# EAGLE design 3PDT Board wLED (EAGLE 9.5.2)
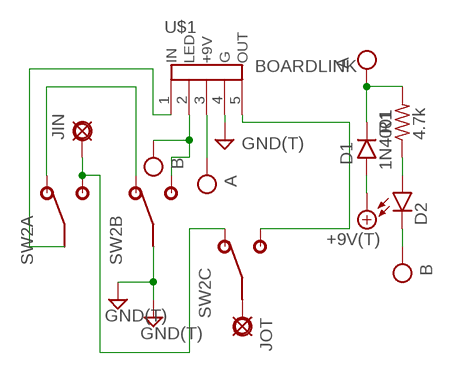
[diagram p0: schematic, sheet 1]

## Parts
+9V  +9V(T)  [SQUARE]
D1  1N4001  1N400X.3  [DO41-3]
D2  LED3MM  [LED3MM]
G  GND(T)  [SQUARE]
JIG  GND(T)  [SQUARE]
JIN  PAD  [SQUARE]
JOG  GND(T)  [SQUARE]
JOT  PAD  [SQUARE]
R1  4.7k  6MM.3  [R0207/3]
SW2  3PDT  [3PDT]
U$1  BOARDLINK  [BOARDLINK]

## Nets
+9V: +9V.1(+9V) D1.A
A: D1.C R1.2 U$1.3(+9V)
B: D2.K(C) SW2.B3 U$1.2(LED)
GND: G.1(GND) JIG.1(GND) JOG.1(GND) SW2.B2 U$1.4(G)
N$2: JOT.1(PAD) SW2.C2
N$3: SW2.A1 SW2.B1
N$4: JIN.1(PAD) SW2.A3 SW2.C1
N$5: SW2.A2 U$1.1(IN)
N$6: SW2.C3 U$1.5(OUT)
N$7: D2.A R1.1

## Library data of the parts
+9V = mb_supply:+9V(T): +9V Voltage Supply use this to hook up +9v throughout a schematic instead of running wire automatically labels the net "+9v" adds a hookup pad to the circuit board
D1 = mb_diodes:1N400X: Rectifier Diodes often used in power supply to prevent damage from reverse polarization
D2 = mb_diodes:LED
G JIG JOG = mb_supply:GND(T): Ground use this to hook up ground (GND) throughout a schematic instead of running wire automatically labels the net "GND" adds a hookup pad to the circuit board (you can use several)
JIN JOT = mb_supply:PAD: PAD use this package for pads with any purpose, including input, output, send or return various pad shapes: round, square, octogonal, long, and long offset
R1 = mb_resistors:6MM: 6mm Resistors Leads spaced 1-6 holes apart for 0.1" perfboard. Suitable for 1/4 watt resistors.
SW2 = mb_switches:3PDT
U$1 = xc_library:BOARDLINK

## Net classes
0 default: clearance 0.205 mm

## Board
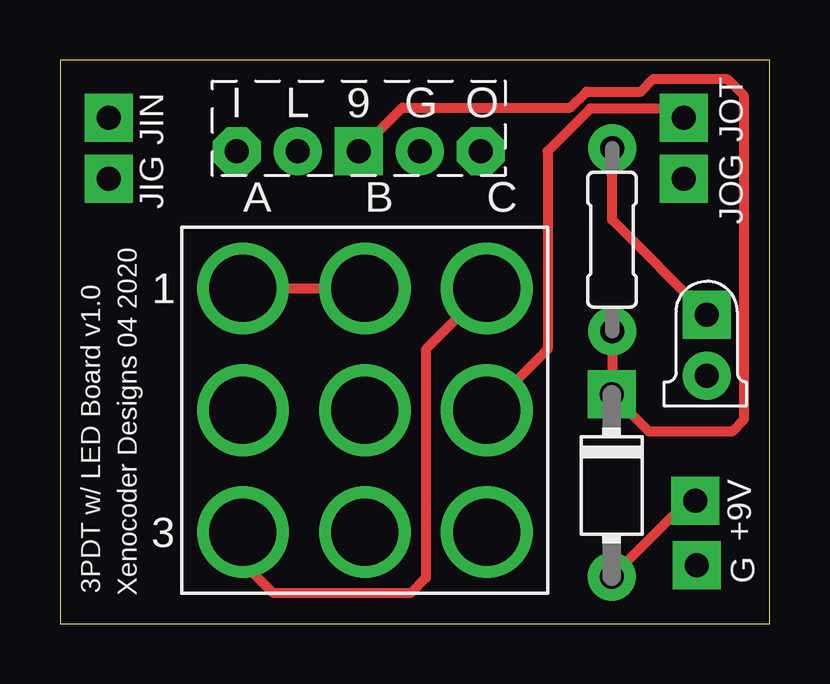
[diagram p1: board, top side]
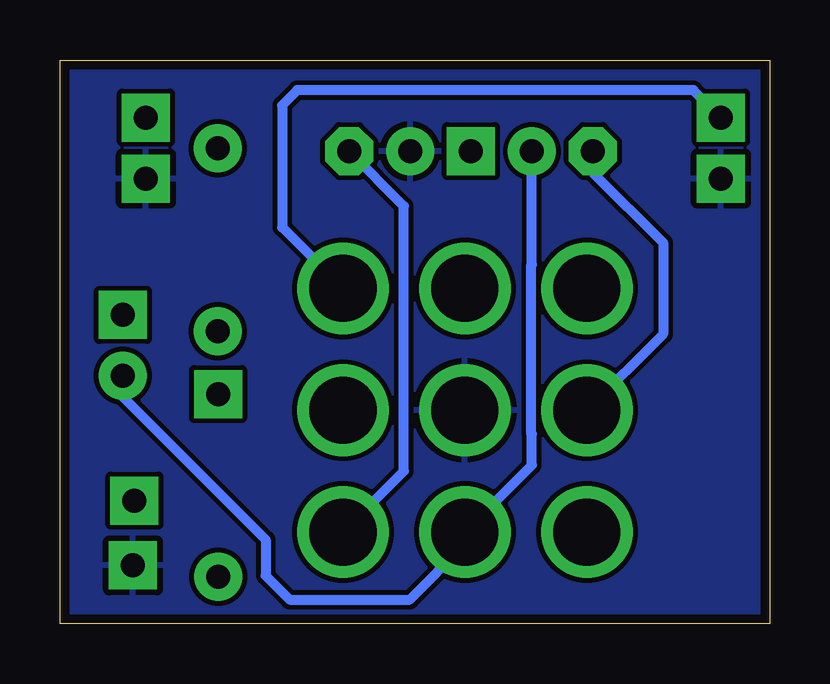
[diagram p2: board, bottom side, seen from below]

Size 29.57 x 23.48 mm. Coordinates in mm from the lower left corner, seen from the top.
Outline: 0,0 29.57,0 29.57,23.48 0,23.48 0,0
Copper layers (1*16): Top 0.035559375mm / dielectric 1.6mm / Bottom 0.035559375mm
Design rules "oshpark-2layer": minimum track width 6mil, minimum drill 10mil, track to track 6mil, track to pad 6mil, pad to pad 6mil, via to via 6mil, smd to smd 6mil, copper to edge 15mil, drill to drill 6mil, minimum pad ring 5mil, minimum via ring 5mil, stop-mask expansion 2.5mil, vias tented up to drill 0mil, thermal gap 10mil

### Footprints (pad centres in the part's own frame; a part is rotated, then mirrored left to right if it is on the bottom)
SQUARE = drill 1 pad 2 square: 1 0,0
DO41-3 = drill 1 pad 2: A 3.81,0 | drill 1 pad 2 square: C -3.81,0
LED3MM = drill 1 pad 2 square: A -1.27,0 | drill 1 pad 2: K 1.27,0
R0207/3 = drill 1 pad 2: 1 -3.81,0; 2 3.81,0
3PDT = drill 2.8 pad 2: A1 -5.08,5.08; A2 -5.08,0; A3 -5.08,-5.08; B1 0,5.08; B2 0,0; B3 0,-5.08; C1 5.08,5.08; C2 5.08,0; C3 5.08,-5.08
BOARDLINK = drill 1 pad 2 octagon: 1 -2.54,0; 5 7.62,0 | drill 1 pad 2: 2 0,0; 4 5.08,0 | drill 1 pad 2 square: 3 2.54,0

### Placement (x,y rotation side)
+9V  26.47,5.13 0 top
D1  22.98,5.76 270 top
D2  26.95,11.6 270 top
G  26.53,2.43 0 top
JIG  2.03,18.54 0 top
JIN  2.03,21.08 0 top
JOG  25.99,18.54 0 top
JOT  25.99,21.08 0 top
R1  23,16 270 top
SW2  12.7,8.89 0 top
U$1  9.91,19.68 0 top

### Tracks (layer width: path | path; a pad name or v marks a point on that pad's centre or on a via)
+9V
  Top 0.406: +9V.1 26.16,5.13 D1.A
A
  Top 0.406: U$1.3 14.26,21.5 21.27,21.5 21.94,22.17 24.2,22.17 24.73,22.7 27.8,22.7 28.49,22.01 28.49,8.49 28,8 24.55,8 D1.C 23,9.59 R1.2
B
  Bottom 0.406: U$1.2 9.91,14.96 9.94,14.93 9.94,7.93 9.91,7.9 9.91,6.6 SW2.B3 12.7,3.3 15,1 20,1 21,2 21,3.5 26.95,9.45 D2.K
GND
  pour Bottom: 0,23.5 0,0 29.77,0 29.77,23.5
N$2
  Top 0.406: JOT.1 25.61,21.45 22.09,21.45 20.32,19.68 20.32,11.43 SW2.C2
N$3
  Top 0.406: SW2.A1 SW2.B1
N$4
  Top 0.406: SW2.A3 7.62,2.54 8.89,1.27 14.61,1.27 15.24,1.91 15.24,11.43 SW2.C1
  Bottom 0.406: JIN.1 3.17,22.23 19.68,22.23 20.32,21.59 20.32,16.51 SW2.C1
N$5
  Bottom 0.406: U$1.1 7.37,18.8 4.45,15.88 4.45,12.06 SW2.A2
N$6
  Bottom 0.406: SW2.C3 15.24,6.35 15.24,17.4 U$1.5
N$7
  Top 0.406: D2.A 23,16.82 R1.1

### Text on the board
tNames: 3PDT w/ LED Board v1.0 | Xenocoder Designs 04 2020